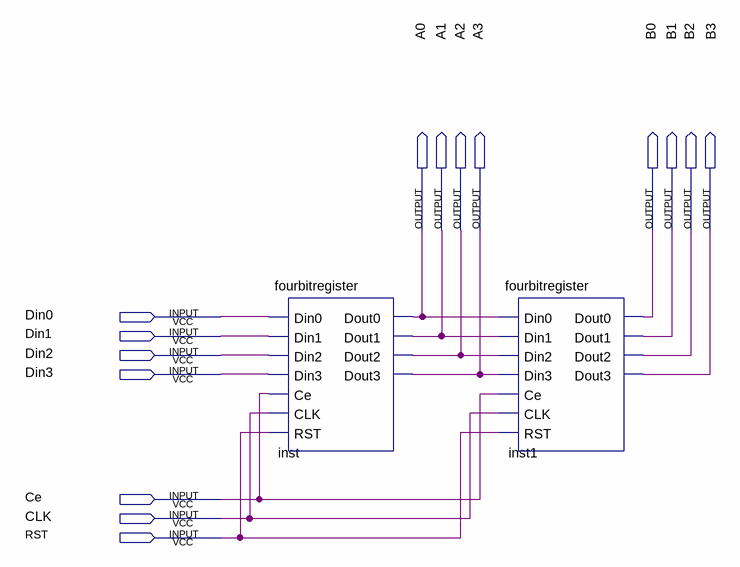
[diagram p0: schematic sheet]
// Quartus schematic week4_ex5.bdf as structural Verilog: 2 symbols, 15 pins
module week4_ex5 (
  input  Din0,
  input  Din1,
  input  Din2,
  input  Din3,
  input  Ce,
  input  CLK,
  input  RST,
  output A0,
  output A1,
  output A2,
  output A3,
  output B0,
  output B1,
  output B2,
  output B3
);

  fourbitregister inst (
    .Din0(Din0), .Din1(Din1), .Din2(Din2), .Din3(Din3), .Ce(Ce), .CLK(CLK), .RST(RST), .Dout0(A0),
    .Dout1(A1), .Dout2(A2), .Dout3(A3));
  fourbitregister inst1 (
    .Din0(A0), .Din1(A1), .Din2(A2), .Din3(A3), .Ce(Ce), .CLK(CLK), .RST(RST), .Dout0(B0), .Dout1(B1),
    .Dout2(B2), .Dout3(B3));
endmodule
